# EAGLE design pinoccio-4x1a-motor (EAGLE 6.4)
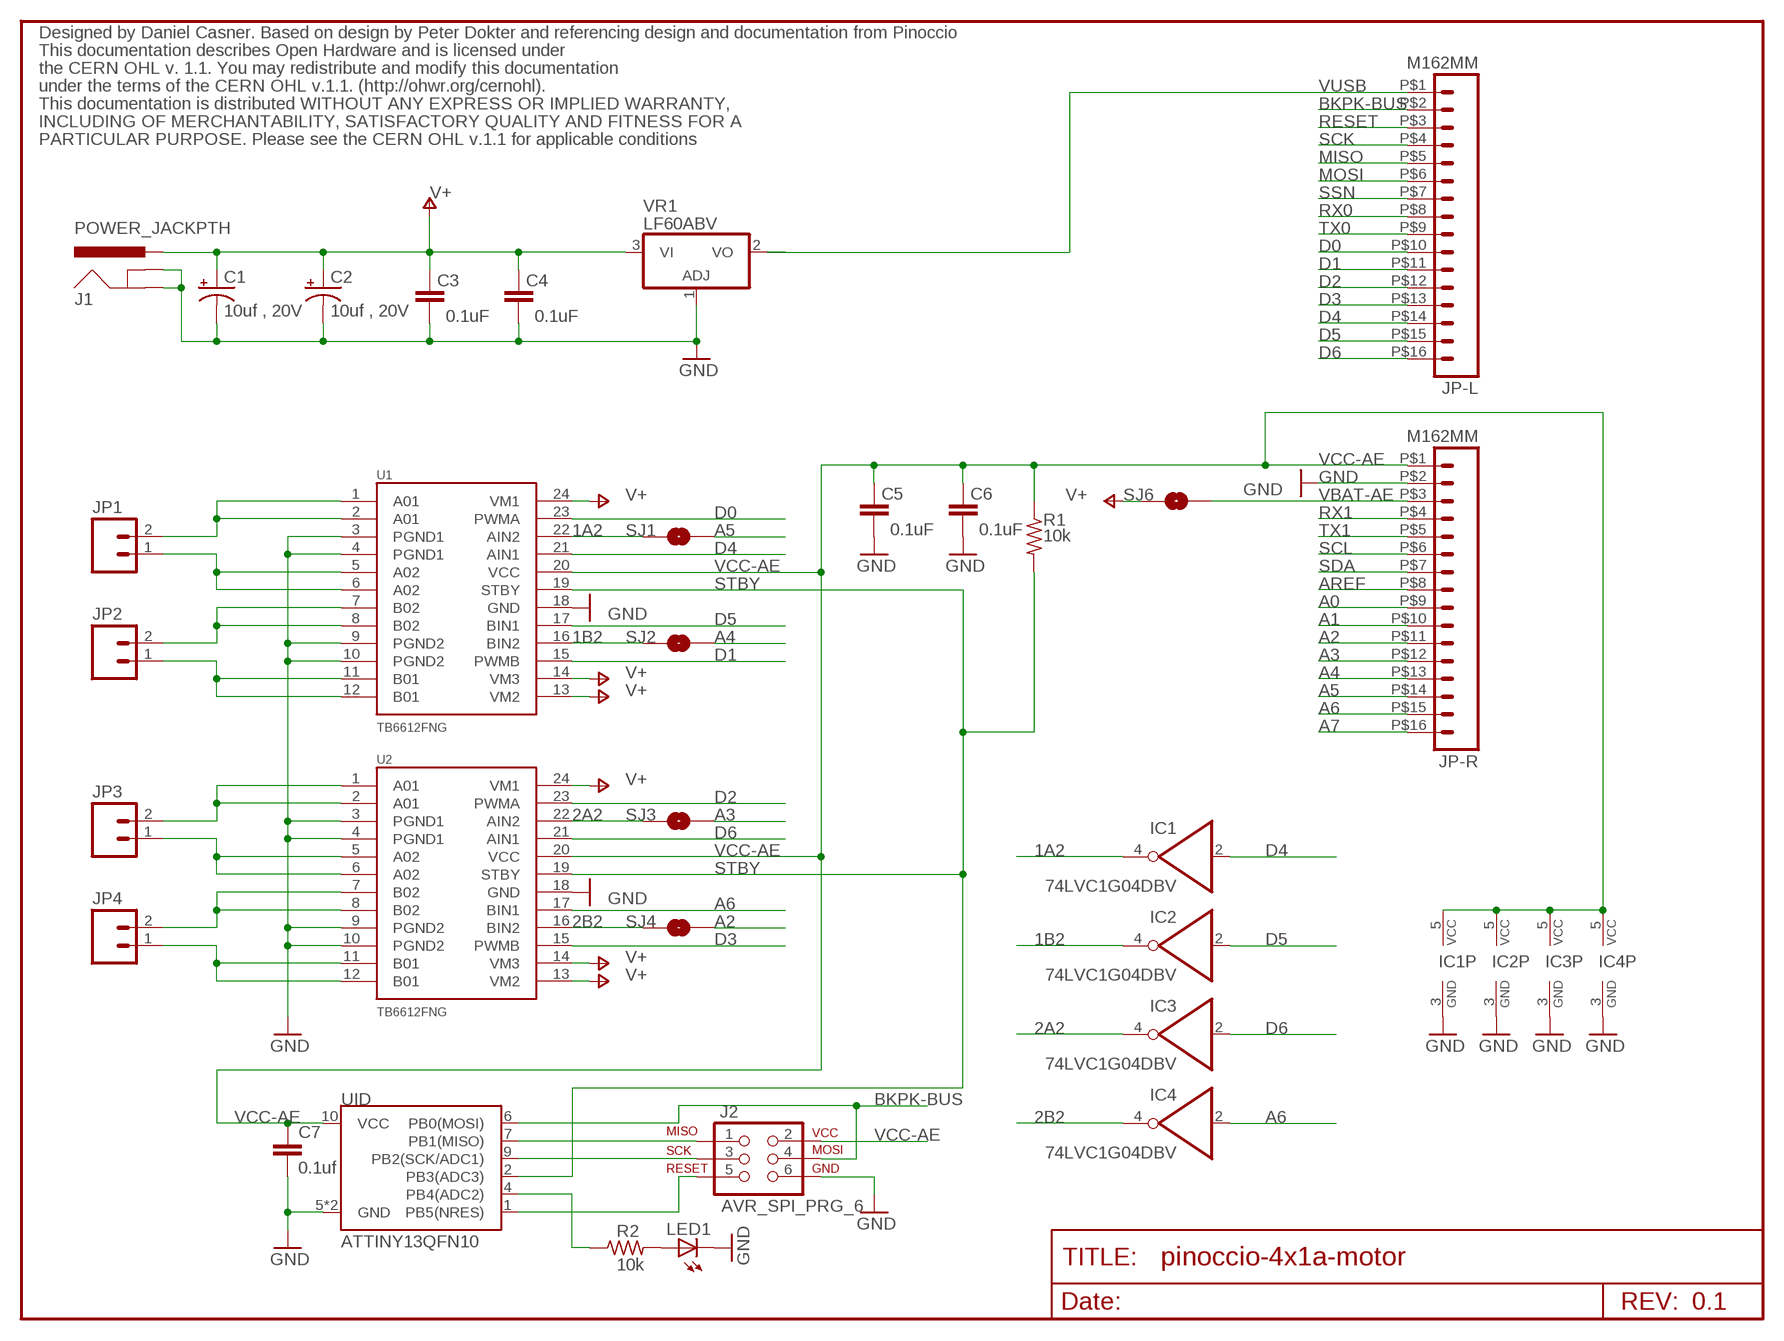
[diagram p0: schematic, sheet 1]

## Parts
C1  10uf , 20V  CAP_POL3528  [EIA3528]
C2  10uf , 20V  CAP_POL3528  [EIA3528]
C3  0.1uF  CAP0402-CAP  [0402-CAP]
C4  0.1uF  CAP0402-CAP  [0402-CAP]
C5  0.1uF  CAP0402-CAP  [0402-CAP]
C6  0.1uF  CAP0402-CAP  [0402-CAP]
C7  0.1uf  CAP0402-CAP  [0402-CAP]
IC1  74LVC1G04DBV  [SOT23-5]
IC2  74LVC1G04DBV  [SOT23-5]
IC3  74LVC1G04DBV  [SOT23-5]
IC4  74LVC1G04DBV  [SOT23-5]
J1  POWER_JACKPTH  [POWER_JACK_PTH]
J2  AVR_SPI_PRG_6  [2X3-PAD]
JP1  M02LOCK_LONGPADS  [1X02_LOCK_LONGPADS]
JP2  M02LOCK_LONGPADS  [1X02_LOCK_LONGPADS]
JP3  M02LOCK_LONGPADS  [1X02_LOCK_LONGPADS]
JP4  M02LOCK_LONGPADS  [1X02_LOCK_LONGPADS]
JP-L  M162MM  [1X16_2MM]
JP-R  M162MM  [1X16_2MM]
LED1  LED0603  [LED-0603]
R1  10k  R-US_R0402  [R0402]
R2  10k  R-US_R0402  [R0402]
SJ1  SOLDERJUMPERNC2  [SJ_2S-NOTRACE]
SJ2  SOLDERJUMPERNC2  [SJ_2S-NOTRACE]
SJ3  SOLDERJUMPERNC2  [SJ_2S-NOTRACE]
SJ4  SOLDERJUMPERNC2  [SJ_2S-NOTRACE]
SJ6  SOLDERJUMPERNC2  [SJ_2S-NOTRACE]
U1  TB6612FNG  TB6621FNG  [SSOP24]
U2  TB6612FNG  TB6621FNG  [SSOP24]
UID  ATTINY13QFN10  [QFN-10]
VR1  LF60ABV  317T  [TO220H]

## Nets
1A2: IC1.4(O) SJ1.1 U1.22(AIN2)
1B2: IC2.4(O) SJ2.1 U1.16(BIN2)
2A2: IC3.4(O) SJ3.1 U2.22(AIN2)
2B2: IC4.4(O) SJ4.1 U2.16(BIN2)
A0: JP-R.P$9
A1: JP-R.P$10
A2: JP-R.P$11 SJ4.2
A3: JP-R.P$12 SJ3.2
A4: JP-R.P$13 SJ2.2
A5: JP-R.P$14 SJ1.2
A6: IC4.2(I) JP-R.P$15 U2.17(BIN1)
A7: JP-R.P$16
AREF: JP-R.P$8
BKPK-BUS [GND]: J2.4 JP-L.P$2 UID.6(PB0(MOSI))
D0: JP-L.P$10 U1.23(PWMA)
D1: JP-L.P$11 U1.15(PWMB)
D2: JP-L.P$12 U2.23(PWMA)
D3: JP-L.P$13 U2.15(PWMB)
D4: IC1.2(I) JP-L.P$14 U1.21(AIN1)
D5: IC2.2(I) JP-L.P$15 U1.17(BIN1)
D6: IC3.2(I) JP-L.P$16 U2.21(AIN1)
GND [GND]: C1.C(-) C2.C(-) C3.1 C4.1 C5.1 C6.1 C7.2 IC1.3(GND) IC2.3(GND) IC3.3(GND) IC4.3(GND) J1.GND J1.GNDBREAK J2.6 JP-R.P$2 LED1.C U1.3(PGND1) U1.4(PGND1) U1.9(PGND2) U1.10(PGND2) U1.18(GND) U2.3(PGND1) U2.4(PGND1) U2.9(PGND2) U2.10(PGND2) U2.18(GND) UID.5(GND) UID.EP(GND) VR1.1(ADJ)
M1+: JP1.2 U1.1(A01) U1.2(A01)
M1-: JP1.1 U1.5(A02) U1.6(A02)
M2+: JP2.2 U1.7(B02) U1.8(B02)
M2-: JP2.1 U1.11(B01) U1.12(B01)
M3+: JP3.2 U2.1(A01) U2.2(A01)
M3-: JP3.1 U2.5(A02) U2.6(A02)
M4+: JP4.2 U2.7(B02) U2.8(B02)
M4-: JP4.1 U2.11(B01) U2.12(B01)
MISO: JP-L.P$5
MOSI: JP-L.P$6
N$1: R2.1 UID.4(PB4(ADC2))
N$2: J2.1 UID.7(PB1(MISO))
N$3: J2.3 UID.9(PB2(SCK/ADC1))
N$4: J2.5 UID.1(PB5(NRES))
N$5: LED1.A R2.2
RESET: JP-L.P$3
RX0: JP-L.P$8
RX1: JP-R.P$4
SCK: JP-L.P$4
SCL: JP-R.P$6
SDA: JP-R.P$7
SSN: JP-L.P$7
STBY: R1.2 U1.19(STBY) U2.19(STBY) UID.2(PB3(ADC3))
TX0: JP-L.P$9
TX1: JP-R.P$5
V+: C1.A(+) C2.A(+) C3.2 C4.2 J1.PWR SJ6.1 U1.13(VM2) U1.14(VM3) U1.24(VM1) U2.13(VM2) U2.14(VM3) U2.24(VM1) VR1.3(VI)
VBAT-AE: JP-R.P$3 SJ6.2
VCC-AE: C5.2 C6.2 C7.1 IC1.5(VCC) IC2.5(VCC) IC3.5(VCC) IC4.5(VCC) J2.2 JP-R.P$1 R1.1 U1.20(VCC) U2.20(VCC) UID.10(VCC)
VUSB: JP-L.P$1 VR1.2(VO)

## Notes on the sheet
- Designed by Daniel Casner. Based on design by Peter Dokter and referencing design and documentation from Pinoccio
- This documentation describes Open Hardware and is licensed under
- the CERN OHL v. 1.1. You may redistribute and modify this documentation
- under the terms of the CERN OHL v.1.1. (http://ohwr.org/cernohl).
- This documentation is distributed WITHOUT ANY EXPRESS OR IMPLIED WARRANTY,
- INCLUDING OF MERCHANTABILITY, SATISFACTORY QUALITY AND FITNESS FOR A
- PARTICULAR PURPOSE. Please see the CERN OHL v.1.1 for applicable conditions
- 0.1
- /Volumes/Data/Users/eric/Desktop/pinoccio.bmp
- /Volumes/Data/Users/eric/Desktop/pinoccio-1in.bmp | /Volumes/Data/Users/eric/Desktop/pinoccio-full-3-4in.bmp | /Volumes/Data/Users/eric/Desktop/pinoccio-full-3-4in.bmp

## Library data of the parts
C1 C2 = SparkFun:CAP_POL: Capacitor Polarized These are standard SMD and PTH capacitors. Normally 10uF, 47uF, and 100uF in electrolytic and tantalum varieties. Always verify the external diameter of the through hole cap, it varies with capacity, voltage, and manufacturer. The EIA devices should be standard.
C3-C6 = SparkFun:CAP: Capacitor Standard 0603 ceramic capacitor, and 0.1" leaded capacitor.
C7 = Pinoccio:CAP: Capacitor Standard 0603 ceramic capacitor, and 0.1" leaded capacitor.
IC1-IC4 = 74xx-little-de:74*1G04: INVERTER Gate
J1 = SparkFun-Connectors:POWER_JACK: Power Jack This is the standard 5.5mm barrel jack for power. The PTH is the most common, proven, reliable, footprint. All others are experimental. The Slot footprint only works if the mill layer is transmitted to the PCB fab house so be warned. Spark Fun Electronics SKU : PRT-00119. Mating wall wart : TOL-00298 (and others)
J2 = Pinoccio:AVR_SPI_PRG_6: AVR ISP 6 Pin This is the reduced ISP connector for AVR programming. Common on Arduino. This footprint will take up less PCB space and can be used with a 10-pin to 6-pin adapter such as SKU: BOB-08508
JP1-JP4 = SparkFun-Connectors:M02: Header 2 Standard 2-pin 0.1" header. Use with straight break away headers (SKU : PRT-00116), right angle break away headers (PRT-00553), swiss pins (PRT-00743), machine pins (PRT-00117), and female headers (PRT-00115). Molex polarized connector foot print use with SKU : PRT-08233 with associated crimp pins and housings.
JP-L JP-R = Pinoccio:M16
LED1 = SparkFun-LED:LED: LEDs Standard schematic elements and footprints for 5mm, 3mm, 1206, and 0603 sized LEDs. 5mm - Spark Fun Electronics SKU : COM-00529 (and others)
R1 R2 = rcl:R-US_: RESISTOR, American symbol
SJ1-SJ4 SJ6 = SparkFun-Passives:SOLDERJUMPER: Solder Jumper Standard SMD solder jumper. Used to automate production. Two varients : Normally Open and Normally Closed are the same, but have different paste layers. NC will have a large amount of paste and should jumper during reflow.
U1 U2 = SparkFun:TB6621FNG: Toshiba 1A motor driver
UID = Pinoccio:ATTINY13
VR1 = linear:*317: Positive VOLTAGE REGULATOR

## Net classes
0 Default: width 0.203 mm
1 VCC: width 0.305 mm
2 LEDPower: width 0.203 mm
3 ButtonSignal: width 0.203 mm
4 RF Antenna: width 0.305 mm
5 GND: width 0.203 mm

## Board
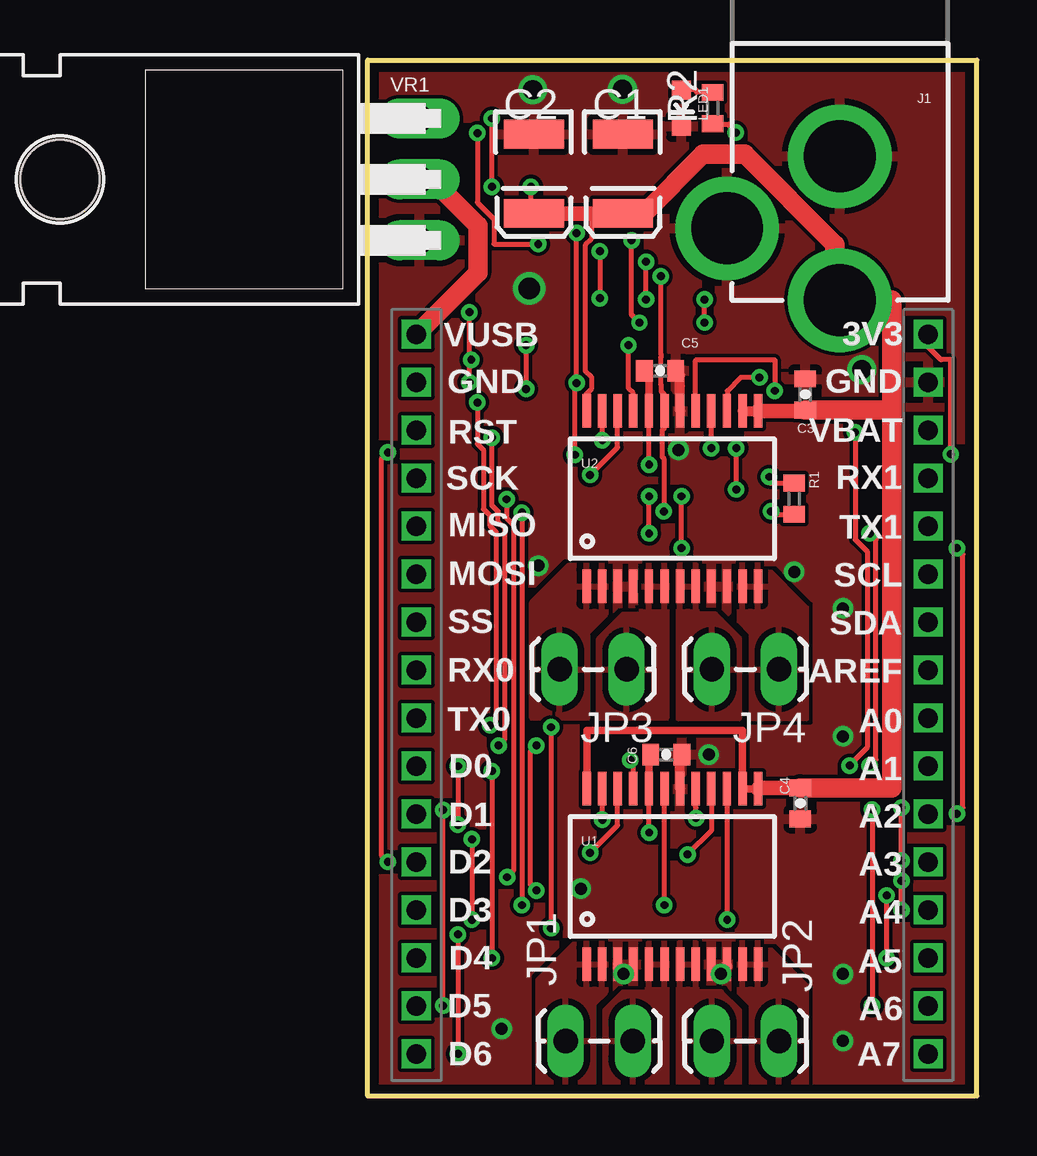
[diagram p1: board, top side]
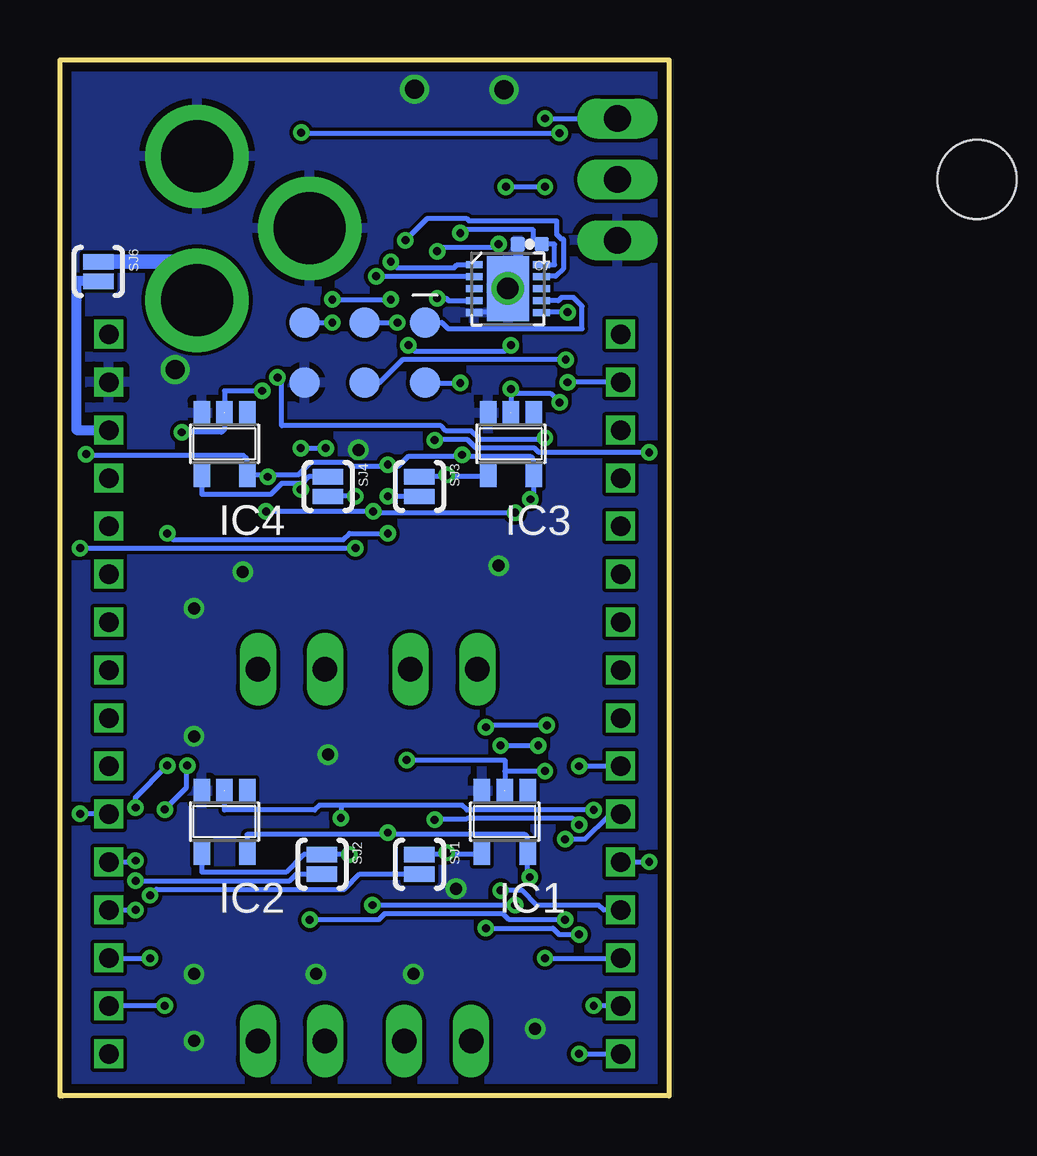
[diagram p2: board, bottom side, seen from below]

Size 25.4 x 43.18 mm. Coordinates in mm from the lower left corner, seen from the top.
Outline: 0,0 0,43.18 25.4,43.18 25.4,0
Outline: 0.03,0 25.3,0 25.32,0.02
Copper layers (1*16): Top 0.0356mm / dielectric 1.5011mm / Bottom 0.0356mm
Design rules "LaenPCBOrder": minimum track width 6mil, minimum drill 13mil, track to track 6mil, track to pad 6mil, pad to pad 6mil, via to via 6mil, smd to smd 6mil, copper to edge 15mil, drill to drill 6mil, minimum pad ring 7mil, minimum via ring 7mil, stop-mask expansion 4mil, vias tented up to drill 0mil, thermal gap 10mil

### Footprints (pad centres in the part's own frame; a part is rotated, then mirrored left to right if it is on the bottom)
EIA3528 = smd 1.2 x 2.5: A 1.65,0; C -1.65,0
0402-CAP = smd 0.7 x 0.9: 1 -0.65,0; 2 0.65,0
0402-CAP' = smd 0.6 x 0.6: 1 -0.5,0; 2 0.5,0
SOT23-5 = smd 0.69 x 0.99: 1 -0.95,-1.29; 2 0,-1.29; 3 0.95,-1.29; 4 0.95,1.3; 5 -0.95,1.3
POWER_JACK_PTH = drill 2.997 pad 4.318: GND 0,7.7; GNDBREAK 4.7,10.7; PWR 0,13.7
2X3-PAD = smd 1.27 x 1.27: 1 0,0; 2 0,2.508; 3 2.508,0; 4 2.508,2.508; 5 5.016,0; 6 5.016,2.508
1X02_LOCK_LONGPADS = drill 1.016 long: 1 -0.127,0; 2 2.667,0
1X16_2MM = drill 0.813 square: P$1 0,0; P$2 2,0; P$3 4,0; P$4 6,0; P$5 8,0; P$6 10,0; P$7 12,0; P$8 14,0; P$9 16,0; P$10 18,0; P$11 20,0; P$12 22,0; P$13 24,0; P$14 26,0; P$15 28,0; P$16 30,0
LED-0603 = smd 0.8 x 0.8: A 0,-0.75; C 0,0.75
R0402 = smd 0.7 x 0.9: 1 -0.65,0; 2 0.65,0
SJ_2S-NOTRACE = smd 0.635 x 1.27: 1 -0.401,0; 2 0.413,0
SSOP24 = smd 0.348 x 1.397: 1 -3.575,-3.656; 2 -2.925,-3.656; 3 -2.275,-3.656; 4 -1.625,-3.656; 5 -0.975,-3.656; 6 -0.325,-3.656; 7 0.325,-3.656; 8 0.975,-3.656; 9 1.625,-3.656; 10 2.275,-3.656; 11 2.925,-3.656; 12 3.575,-3.656; 13 3.575,3.656; 14 2.925,3.656; 15 2.275,3.656; 16 1.625,3.656; 17 0.975,3.656; 18 0.325,3.656; 19 -0.325,3.656; 20 -0.975,3.656; 21 -1.625,3.656; 22 -2.275,3.656; 23 -2.925,3.656; 24 -3.575,3.656
QFN-10 = smd 0.7 x 0.3: 1 -1.4,1; 2 -1.4,0.5; 3 -1.4,0; 4 -1.4,-0.5; 5 -1.4,-1; 6 1.4,-1; 7 1.4,-0.5; 8 1.4,0; 9 1.4,0.5; 10 1.4,1 | smd 1.75 x 2.7: EP 0,0
TO220H = drill 1.118 long: 1 -2.54,-10.16; 2 0,-10.16; 3 2.54,-10.16 | hole 3.302: 0,4.826

### Placement (x,y rotation side)
C1  10.64,38.43 270 top
C2  6.93,38.43 270 top
C3  18.24,29.24 270 top
C4  18.03,12.19 90 top
C5  12.19,30.23 180 top
C6  12.45,14.22 180 top
C7  0.1uf  [0402-CAP']  5.82,35.51 180 bottom
IC1  6.86,11.43 180 bottom
IC2  18.54,11.43 180 bottom
IC3  6.6,27.18 180 bottom
IC4  18.54,27.18 180 bottom
J1  19.68,46.86 180 top
J2  10.19,32.23 180 bottom
JP1  10.92,2.29 180 top
JP2  17.02,2.29 180 top
JP3  10.67,17.78 180 top
JP4  17.02,17.78 180 top
JP-L  2.03,31.75 270 top
JP-R  23.37,31.75 270 top
LED1  13.08,41.17 180 top
R1  17.78,24.89 270 top
R2  14.38,41.17 90 top
SJ1  10.41,9.65 270 bottom
SJ2  14.48,9.65 270 bottom
SJ3  10.41,25.4 270 bottom
SJ4  14.22,25.4 270 bottom
SJ6  23.8,34.37 270 bottom
U1  12.7,9.14 0 top
U2  12.7,24.89 0 top
UID  6.73,33.66 0 bottom
VR1  -8,38.2 90 top

### Tracks (layer width: path | path; a pad name or v marks a point on that pad's centre or on a via)
1A2  (via drill 0.33)
  Top 0.203: v9.27,10.13 10.41,11.28 10.41,12.78 U1.22
  Bottom 0.203: 9.27,10.06 7.8,10.06 7.8,10.11 IC1.4 | 9.27,10.06 SJ1.1 | v9.27,10.13 9.27,10.06
1B2  (via drill 0.33)
  Top 0.203: v13.34,10.06 14.33,11.05 14.33,12.78 U1.16
  Bottom 0.203: v13.34,10.06 SJ2.1 14.55,10.06 15.24,10.06 15.98,9.32 19.48,9.32 19.48,10.11 IC2.4
2A2  (via drill 0.33)
  Top 0.203: v9.27,25.88 10.41,27.03 10.41,28.52 U2.22
  Bottom 0.203: 9.27,25.81 7.54,25.81 7.54,25.86 IC3.4 | 9.27,25.81 SJ3.1 | v9.27,25.88 9.27,25.81
2B2  (via drill 0.33)
  Top 0.203: v14.33,27 14.33,28.52 U2.16 | v15.37,25.27 v15.37,27
  Bottom 0.203: 15.37,25.53 15.32,25.53 15.04,25.81 SJ4.1 | 15.37,25.53 16.15,25.53 16.61,25.07 19.48,25.07 19.48,25.86 IC4.4 | v15.37,27 v14.33,27 | 15.37,25.53 v15.37,25.27
A2  (via drill 0.33)
  Top 0.203: v13.08,22.83 v13.08,24.99 | v24.56,22.83 24.82,22.58 24.82,12.01 v24.56,11.76
  Bottom 0.203: v13.08,24.99 SJ4.2 | v24.56,22.83 v13.08,22.83 | v24.56,11.76 JP-R.P$11
A3  (via drill 0.33)
  Top 0.203: v11.73,23.44 v11.73,24.99 | v20.93,23.44 21.18,23.19 21.18,14.02 v20.93,13.77 | v22.25,9.8 v22.25,12.01
  Bottom 0.203: v11.73,24.99 SJ3.2 | v11.73,23.44 13.34,23.44 13.59,23.19 20.68,23.19 v20.93,23.44 | v20.93,13.77 22.25,12.45 v22.25,12.01 | v22.25,9.8 22.3,9.75 JP-R.P$12
A4  (via drill 0.33)
  Top 0.203: v22.25,7.75 v22.25,8.97
  Bottom 0.203: v22.25,8.97 15.82,8.97 15.54,9.25 SJ2.2 | v22.25,7.75 JP-R.P$13
A5  (via drill 0.33)
  Top 0.203: v21.64,5.74 v21.64,8.36
  Bottom 0.203: v21.64,8.36 21.39,8.61 13.54,8.61 12.9,9.25 SJ1.2 | v21.64,5.74 JP-R.P$14
A6  (via drill 0.33)
  Top 0.203: v16.97,29.39 16.97,30.68 13.69,30.68 13.66,30.66 U2.17 | v21.03,11.94 v21.03,3.76 | v20.09,13.77 20.32,13.99 20.32,14.02 20.83,14.53 20.83,22.68 20.32,23.19 v20.32,27.66
  Bottom 0.203: v16.97,29.39 18.54,29.39 IC4.2 18.54,27.79 18.67,27.66 v20.32,27.66 | v21.03,3.76 JP-R.P$15 | v21.03,11.94 20.14,12.83 20.14,13.77 v20.09,13.77
BKPK-BUS  (via drill 0.33)
  Top 0.203: v4.24,29.74 4.24,30.68 | 4.24,30.68 v4.24,32.66 | v4.32,30.68 4.24,30.68
  Bottom 0.203: v4.24,32.66 5.31,32.66 UID.6 | v4.24,29.74 JP-L.P$2 | v4.32,30.68 11.12,30.68 12.09,29.72 12.68,29.72 J2.4
D0  (via drill 0.33)
  Top 0.203: v9.78,11.51 9.78,12.78 U1.23 | v3.76,13.74 v3.76,11.3
  Bottom 0.203: v9.78,11.51 9.75,11.53 8.46,11.53 8.43,11.56 4.01,11.56 v3.76,11.3 | v3.76,13.74 JP-L.P$10
D1  (via drill 0.33)
  Top 0.203: v14.99,7.34 14.99,12.78 U1.15 | v4.34,10.69 v4.34,7.34
  Bottom 0.203: v14.99,7.34 12.12,7.34 11.86,7.59 6.93,7.59 6.68,7.34 v4.34,7.34 | v4.34,10.69 3.5,10.69 2.54,11.66 2.54,11.76 JP-L.P$11
D2  (via drill 0.33)
  Top 0.203: v9.78,27.33 9.78,28.52 U2.23 | v0.84,26.82 0.58,26.57 0.58,10.01 v0.84,9.75
  Bottom 0.203: v9.78,27.33 9.75,27.36 8.41,27.36 8.05,27 5.61,27 5.44,26.82 v0.84,26.82 | v0.84,9.75 JP-L.P$12
D3  (via drill 0.33)
  Top 0.203: v16.33,29.95 15.54,29.95 14.99,29.39 14.99,28.55 U2.15 | v5.18,27.43 5.18,24.61 5.44,24.36 5.44,23.93 5.71,23.65 5.71,14.86 v5.46,14.61 | v7.04,14.61 6.78,14.35 6.78,8.81 v7.04,8.56
  Bottom 0.203: v16.33,29.95 16.15,29.77 16.15,27.94 9.53,27.94 9.3,27.71 8.26,27.71 7.9,27.36 5.26,27.36 v5.18,27.43 | v7.04,14.61 v5.46,14.61 | v7.04,8.56 6.12,8.56 5.51,7.95 2.95,7.95 2.74,7.75 JP-L.P$13
D4  (via drill 0.33)
  Top 0.203: v10.95,13.99 11.07,13.87 U1.21 | v5.18,13.54 v5.18,5.74
  Bottom 0.203: 6.86,13.54 6.86,13.99 v10.95,13.99 | 6.86,13.54 IC1.2 | v5.18,5.74 JP-L.P$14 | 6.86,13.54 v5.18,13.54
D5  (via drill 0.33)
  Top 0.203: v3.15,3.76 v3.15,11.91 | v13.69,11.58 13.69,12.01 13.66,12.04 13.66,12.78 U1.17
  Bottom 0.203: IC2.2 18.54,11.91 14.78,11.91 14.58,12.12 13.69,12.12 | 13.69,12.12 8.64,12.12 8.43,11.91 v3.15,11.91 | v3.15,3.76 JP-L.P$15 | 13.69,12.12 v13.69,11.58
D6  (via drill 0.33)
  Top 0.203: v6.6,31.29 v6.6,29.46 | v10.87,31.29 10.87,29.49 11.07,29.29 U2.21 | v3.76,6.73 v3.76,1.75 | v7.64,15.37 v7.64,6.99 | v5.11,15.44 5.36,15.7 5.36,23.49 5.08,23.77 5.08,24.21 4.83,24.46 4.83,26.92 4.57,27.18 v4.57,28.9
  Bottom 0.203: IC3.2 v6.6,29.46 6.53,29.29 4.95,29.29 v4.57,28.9 | v6.6,31.29 6.86,31.04 10.62,31.04 v10.87,31.29 | v3.76,1.75 JP-L.P$16 | v3.76,6.73 4.6,6.73 4.85,6.99 v7.64,6.99 | v7.64,15.37 7.57,15.44 v5.11,15.44
GND  (via drill 0.5, 0.8, 0.9)
  Top 0.406: U1.3 10.43,5.32 v10.67,5.08 | U1.10 14.97,5.32 v14.73,5.08 | U2.18 13.03,30.04 C5.1 | U1.18 13.03,14.15 C6.1
  Bottom 0.203: UID.EP 6.73,32.97 7.04,32.66 8.13,32.66 UID.5 | 7.82,12.72 IC1.3 7.82,12.72
  Bottom 0.406: C7.2 6.32,34.07 UID.EP
  other vias: 14.22,14.22 12.95,26.92 8.89,8.64 17.78,21.84 7.11,22.1 19.81,14.99 19.81,20.32 19.81,5.08 19.81,2.29 5.59,2.79 6.73,33.66 6.88,41.94 10.62,41.96 20.6,30.28
  pour Top (rank 6): 0.08,43.33 0.03,43.33 0.03,-0.03 25.37,-0.03 25.37,0 25.37,43.28 0.08,43.28
  pour Bottom: 0.08,43.15 0.03,43.15 0.03,0.03 24.89,0 25.07,0 25.37,-0.03 25.37,43.26 0.1,43.26
M1+
  pour Top (rank 3): 9.91,6.35 9.91,4.32 9.4,3.81 9.4,0 7.11,0 7.11,4.83 8.64,6.35
M1-
  pour Top (rank 3): 12.45,6.35 12.45,0 9.91,0 9.91,3.56 10.67,4.32 11.68,4.32 11.68,6.35
M2+
  pour Top (rank 3): 15.49,0 15.49,3.56 14.73,4.32 13.72,4.32 13.72,6.35 12.95,6.35 12.95,0
M2-
  pour Top (rank 3): 15.49,6.35 15.49,4.32 16,3.81 16,0 18.29,0 18.29,4.57 16.51,6.35
M3+
  pour Top (rank 3): 9.91,22.1 9.91,20.07 9.14,19.3 9.14,15.75 6.86,15.75 6.86,20.57 8.38,22.1
M3-
  pour Top (rank 3): 12.45,22.1 12.45,15.75 9.65,15.75 9.65,19.05 10.67,20.07 11.43,20.07 11.43,22.1
M4+
  pour Top (rank 3): 15.49,15.75 15.49,19.05 14.48,20.07 13.72,20.07 13.72,22.1 12.95,22.1 12.95,15.75
M4-
  pour Top (rank 3): 15.49,22.1 15.49,19.81 16,19.3 16,15.75 18.29,15.75 18.29,20.32 16.51,22.1
N$1  (via drill 0.33)
  Top 0.203: v9.68,35.2 v9.68,33.25 | v7.11,35.51 5.26,35.51 5.26,36.55 4.57,37.24 v4.57,40.13 | v15.34,40.16 15.09,40.41 15.09,40.49 15.06,40.51 R2.1
  Bottom 0.203: v9.68,33.25 9.3,33.25 9.2,33.15 8.15,33.15 UID.4 | v9.68,35.2 9.53,35.36 7.26,35.36 v7.11,35.51 | v4.57,40.13 15.32,40.13 v15.34,40.16
N$2
  Bottom 0.203: J2.1 9.47,32.23 9.22,31.98 3.63,31.98 3.63,32.92 3.99,33.27 4.5,33.27 4.62,33.15 5.31,33.15 UID.7
N$3  (via drill 0.33)
  Top 0.203: v11,35.66 11,32.56 v11.33,32.23
  Bottom 0.203: v11,35.66 10.08,36.58 8.46,36.58 8.36,36.47 4.7,36.47 4.7,35.92 4.5,35.71 4.42,35.71 4.42,34.47 4.72,34.16 5.31,34.16 UID.9 | J2.3 v11.33,32.23
N$4  (via drill 0.33)
  Top 0.203: v11.61,33.2 v11.61,34.77 | v14.05,32.23 v14.05,33.2
  Bottom 0.203: v11.61,34.77 11.35,34.52 8.97,34.52 8.84,34.65 8.15,34.65 UID.1 | v14.05,33.2 v11.61,33.2 | J2.5 v14.05,32.23
N$5
  Top 0.203: LED1.A 13.08,41.94 13.69,41.94 13.69,41.86 13.72,41.83 14.38,41.83 R2.2
STBY  (via drill 0.33)
  Top 0.203: v12.22,34.16 12.22,30.94 12.24,30.91 12.24,30.81 12.22,30.79 12.22,29.67 12.24,29.64 12.24,29.36 12.37,29.23 U2.19 12.37,28.45 12.37,27.84 12.27,27.74 12.27,26.64 12.34,26.57 v12.34,24.36 | v16.82,24.36 16.82,24.23 R1.2 | v12.37,7.95 12.37,12.78 U1.19 | v6.43,24.31 v6.43,7.95
  Bottom 0.203: v12.22,34.16 8.15,34.16 UID.2 | v16.82,24.36 v12.34,24.36 12.27,24.31 v6.43,24.31 | v6.43,7.95 v12.37,7.95
V+  (via drill 0.33)
  Top 0.203: 9.32,36.78 9.32,35.71 9.07,35.46 9.07,30.23 9.32,29.97 9.32,29.46 9.12,29.26 U2.24 | v5.18,37.9 v5.18,40.74 | v6.81,37.9 6.81,37.08 C2.A
  Top 0.305: U1.13 U1.14 15.62,15.24 9.14,15.24 9.14,12.8 U1.24
  Top 0.406: U2.14 U2.13 | 17.74,28.55 C3.2
  Top 0.61: C2.A 9.32,36.78 C1.A | 17.74,28.55 U2.13 | C4.2 16.32,12.84 U1.13
  Top 0.762: 15.72,39.24 19.48,35.48
  Top 0.813: C4.2 21.84,12.84 21.84,28.59 | C3.2 21.84,28.59 | 21.84,28.59 21.84,33.16 J1.PWR 19.48,33.37 19.48,35.48 | C1.A 11.51,36.78 13.97,39.24 15.72,39.24
  Bottom 0.203: v5.18,40.74 VR1.3 | v6.81,37.9 v5.18,37.9
  Bottom 0.61: SJ6.1 19.68,34.77 J1.PWR
VBAT-AE
  Bottom 0.406: SJ6.2 24.71,33.95 24.71,27.76 23.37,27.76 JP-R.P$3
VCC-AE  (via drill 0.33)
  Top 0.203: v11.73,10.97 11.73,12.65 U1.20 | v8.71,35.97 v8.71,29.72 8.64,29.67 v8.64,26.72 | v16.74,25.81 16.74,25.55 17.78,25.55 R1.1 | v11.73,26.31 11.73,28.4 U2.20 | JP-R.P$1 23.37,31.22 23.9,30.68 24.31,30.68 v24.31,26.75 | v5.82,9.12 6.07,9.37 6.07,23.8 5.79,24.08 v5.79,24.87
  Top 0.305: U2.20 11.72,30.04 C5.2 | U1.20 11.72,14.15 C6.2
  Bottom 0.203: UID.10 5.31,34.65 4.78,34.65 4.78,35.48 4.8,35.51 C7.1 5.69,35.51 5.69,36.12 8.56,36.12 v8.71,35.97 | 11.73,10.9 6.02,10.9 5.92,10.79 IC1.5 5.92,10.03 5.92,9.12 v5.82,9.12 | 11.73,10.9 17.6,10.9 17.6,10.13 IC2.5 | v11.73,10.97 11.73,10.9 | v8.71,29.72 J2.2 | 16.74,25.88 15.47,25.88 14.96,26.39 13.39,26.39 13.23,26.24 11.73,26.24 | 16.74,25.88 17.58,25.88 IC4.5 17.58,25.98 17.6,25.98 17.6,26.54 17.75,26.69 24.26,26.69 v24.31,26.75 | 11.73,26.24 11.3,26.24 10.9,26.64 8.64,26.64 | 8.64,26.64 5.77,26.64 5.66,26.54 5.66,25.88 IC3.5 5.66,25.78 5.66,24.99 v5.79,24.87 | v16.74,25.81 16.74,25.88 | v11.73,26.31 11.73,26.24 | v8.64,26.72 8.64,26.64
VUSB
  Top 0.813: VR1.2 2.67,38.2 4.6,36.27 4.6,34.32 JP-L.P$1

### Text on the board
tPlace: 3V3 | VUSB | GND | GND | VBAT | RST | RX1 | SCK | TX1 | MISO | SCL | MOSI | SDA | SS | AREF | RX0 | A0 | TX0 | A1 | D0 | A2 | D1 | A3 | D2 | A4 | D3 | A5 | D4 | A6 | D5 | A7 | D6
tDocu: 4x 1A motor driver backpack for Pinoccio | Design by: Daniel Casner referencing design by Eric Jennings for Pinoccio | http://danielcasner.org http://pinocc.io | Licensed under CERN OHL v.1.1